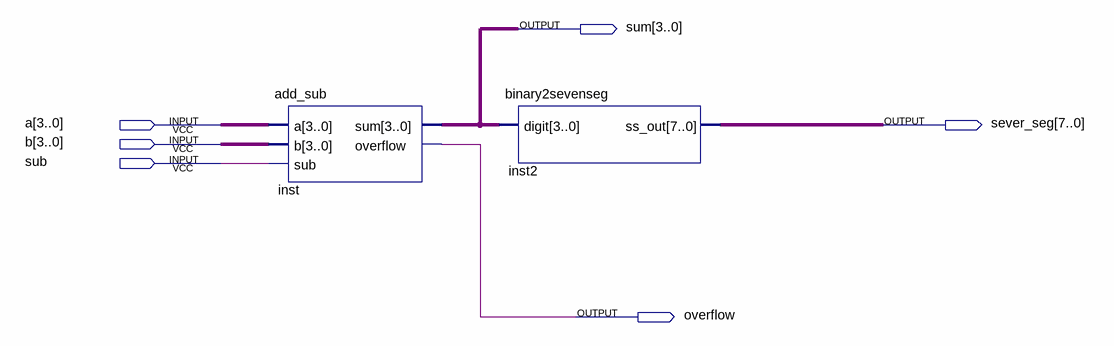
[diagram p0: schematic sheet]
// Quartus schematic arithmetic_circuit.bdf as structural Verilog: 2 symbols, 6 pins
module arithmetic_circuit (
  input  [3:0] a,
  input  [3:0] b,
  input  sub,
  output [3:0] sum,
  output [7:0] sever_seg,
  output overflow
);

  add_sub inst (.a(a), .b(b), .sub(sub), .sum(sum), .overflow(overflow));
  binary2sevenseg inst2 (.digit(sum), .ss_out(sever_seg));
endmodule
